# EAGLE design tetris (EAGLE 8.2.2)
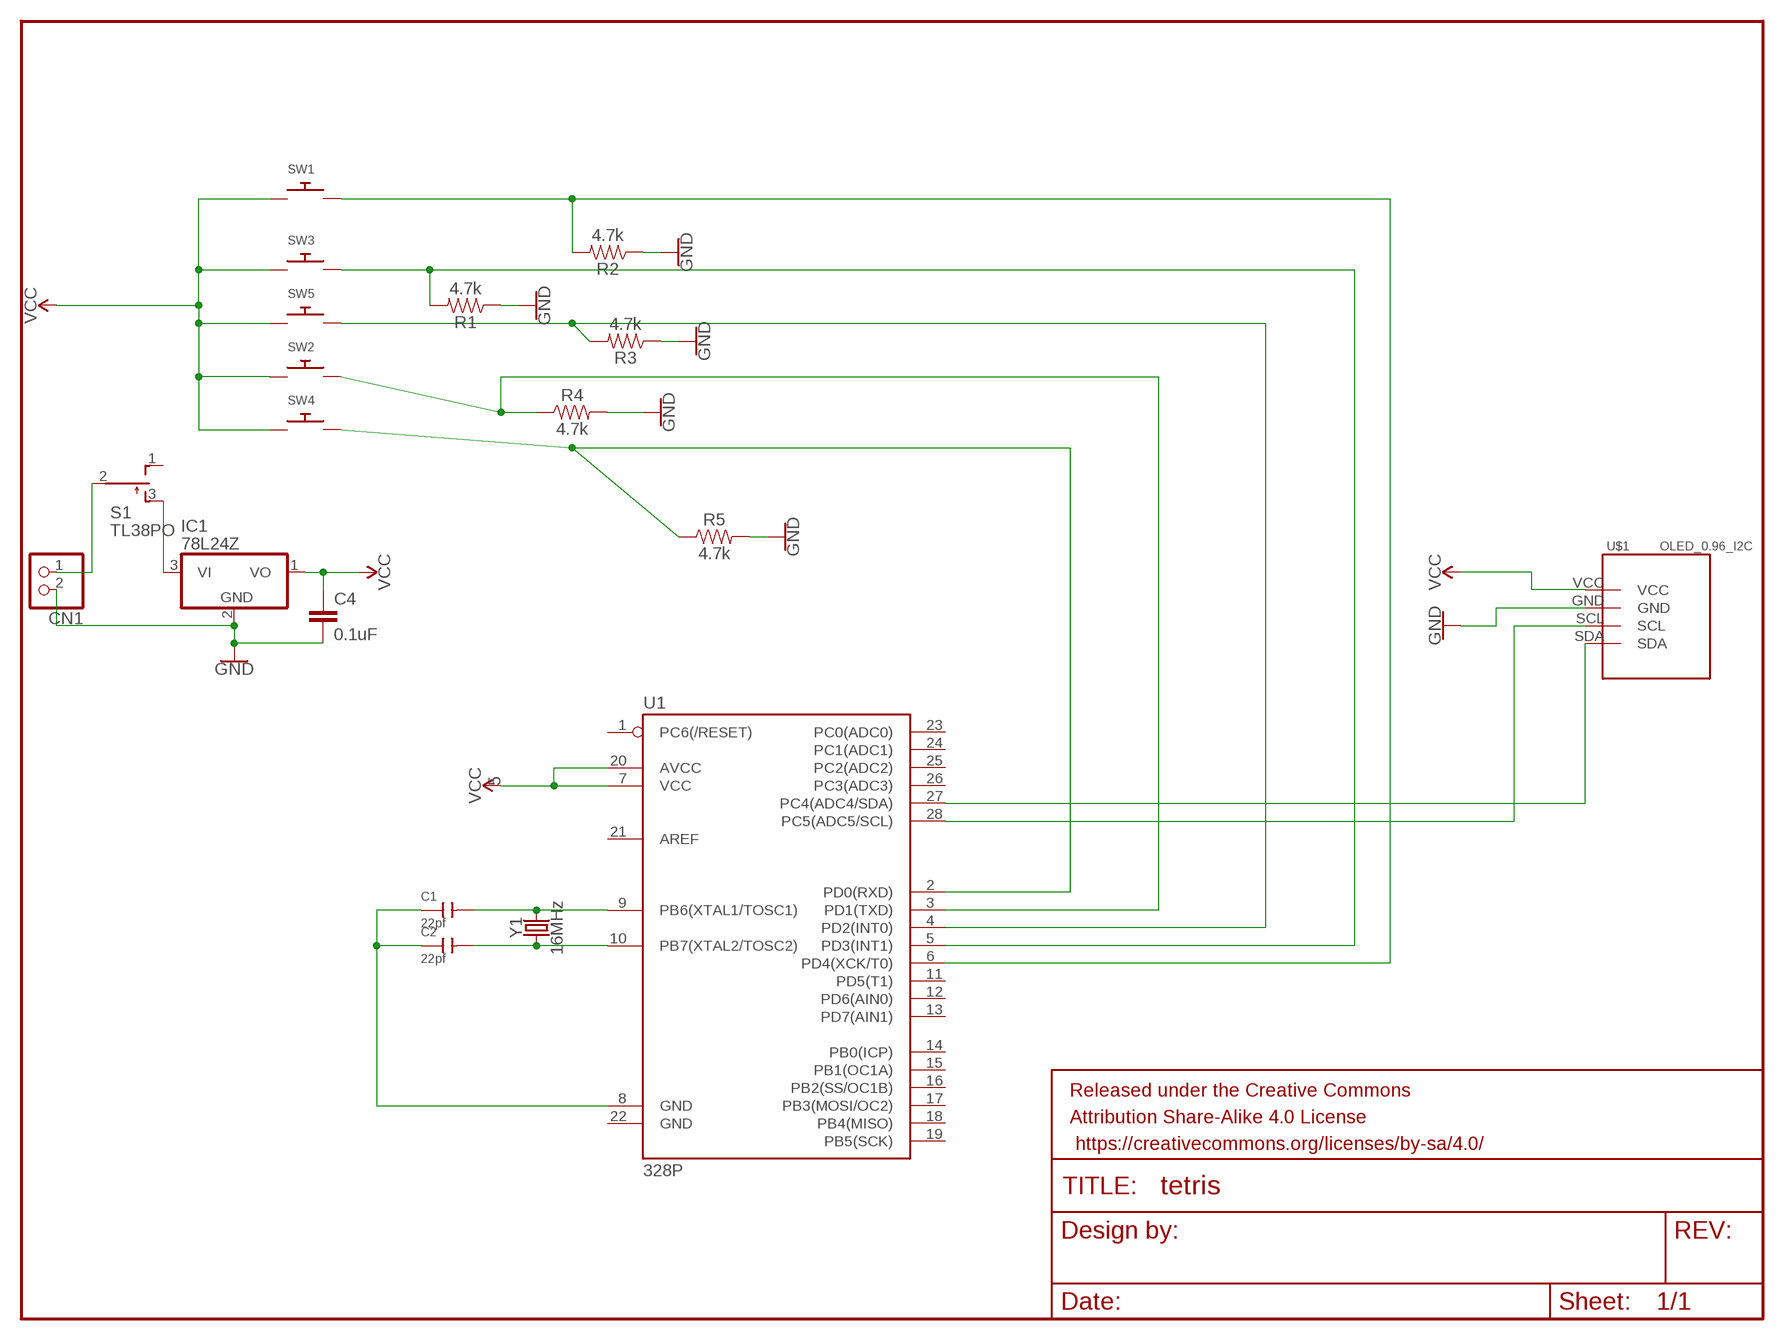
[diagram p0: schematic, sheet 1]

## Parts
C1  22pf  CERAMIC-22PF-50V-5%-NPO(0402)  [C0402]
C2  22pf  CERAMIC-22PF-50V-5%-NPO(0402)  [C0402]
C4  0.1uF  0.1UF-0402-16V-10%  [0402]
CN1  JST_2PIN-SMT-RA  [JST-PH-2-SMT-RA]
FRAME1  FRAME-LETTERNO_PACKAGE  [DUMMY]
IC1  78L24Z  [TO92]
R1  4.7k  4.7KOHM-0603-1/10W-1%  [0603]
R2  4.7k  4.7KOHM-0603-1/10W-1%  [0603]
R3  4.7k  4.7KOHM-0603-1/10W-1%  [0603]
R4  4.7k  4.7KOHM-0603-1/10W-1%  [0603]
R5  4.7k  4.7KOHM-0603-1/10W-1%  [0603]
S1  TL38PO  [TL3XPO]
SW1  SWITCH_PUSHBUTTONC&K_KSS  [BTN_CK_KSS]
SW2  SWITCH_PUSHBUTTONC&K_KSS  [BTN_CK_KSS]
SW3  SWITCH_PUSHBUTTONC&K_KSS  [BTN_CK_KSS]
SW4  SWITCH_PUSHBUTTONC&K_KSS  [BTN_CK_KSS]
SW5  SWITCH_PUSHBUTTONC&K_KSS  [BTN_CK_KSS]
U1  328P  ATMEGA328P_PDIP  [DIP28]
U$1  OLED_0.96_I2C  [OLED_0.96_I2C]
Y1  16MHz  CRYSTAL-16MHZPTH-HC49US  [HC49US]

## Nets
GND: C4.2 CN1.2 IC1.2(GND) R1.1 R2.1 R3.1 R4.2 R5.2 U$1.GND
N$1: R2.2 SW1.P$2 U1.6(PD4(XCK/T0))
N$2: R1.2 SW3.P$2 U1.5(PD3(INT1))
N$3: R3.2 SW5.P$2 U1.4(PD2(INT0))
N$4: R4.1 SW2.P$2 U1.3(PD1(TXD))
N$5: R5.1 SW4.P$2 U1.2(PD0(RXD))
N$6: C1.2 U1.9(PB6(XTAL1/TOSC1)) Y1.2
N$7: C2.2 U1.10(PB7(XTAL2/TOSC2)) Y1.1
N$8: C1.1 C2.1 U1.8(GND)
N$9: CN1.1 S1.2(P)
N$10: U1.27(PC4(ADC4/SDA)) U$1.SDA
N$11: U1.28(PC5(ADC5/SCL)) U$1.SCL
N$12: IC1.3(VI) S1.3(S)
VCC: C4.1 IC1.1(VO) SW1.P$1 SW2.P$1 SW3.P$1 SW4.P$1 SW5.P$1 U1.7(VCC) U1.20(AVCC) U$1.VCC
Unconnected: S1.1(O) U1.1(PC6(/RESET)) U1.11(PD5(T1)) U1.12(PD6(AIN0)) U1.13(PD7(AIN1)) U1.14(PB0(ICP)) U1.15(PB1(OC1A)) U1.16(PB2(SS/OC1B)) U1.17(PB3(MOSI/OC2)) U1.18(PB4(MISO)) U1.19(PB5(SCK)) U1.21(AREF) U1.22(GND) U1.23(PC0(ADC0)) U1.24(PC1(ADC1)) U1.25(PC2(ADC2)) U1.26(PC3(ADC3))

## Library data of the parts
C1 C2 = Seeed-Capacitor:CERAMIC-22PF-50V-5%-NPO(0402): 302010018; MPN: CC0402JRNPO9BN220
C4 = SparkFun-Capacitors:0.1UF: 0.1µF ceramic capacitors A capacitor is a passive two-terminal electrical component used to store electrical energy temporarily in an electric field.; PROD_ID: CAP-12416
CN1 = adafruit:JST_2PIN: JST 2-Pin Connectors of various flavors SMT-RA (S2B-PH-SM4) 4UConnector #17311 SMT (B2B-PH-SM4) THM-RA (S2B-PH) THM (B2B-PH); VOLTS: 5
FRAME1 = SparkFun-Aesthetics:FRAME-LETTER: Schematic Frame - Letter Standard 8.5x11 US Letter frame; DESIGNER: Nobody; VERSION: v01
IC1 = adafruit:78*: Positive VOLTAGE REGULATOR Added bigger pads to the TO-92 package
R1-R5 = SparkFun-Resistors:4.7KOHM: 4.7kΩ resistor A resistor is a passive two-terminal electrical component that implements electrical resistance as a circuit element. Resistors act to reduce current flow, and, at the same time, act to lower voltage levels within circuits. - Wikipedia; PROD_ID: RES-07857
S1 = switch:TL38PO: TINY SWITCH ON OFF MOM Source: http://www2.produktinfo.conrad.com/datenblaetter/700000-724999/705152-da-01-de-Subminiaturschalter_TL_36YO.pdf
SW1 = adafruit:SWITCH_PUSHBUTTON: Buttons SOFTTOUCHSMD_SJ - Soft touch temporary push button (Super Junk Akihabara) Compatible with SKPMANE010 [Mouser: 688-SKPMAN] C&K_KSS = Digikey: KSS221GLFS; PIN: D4
SW2 = adafruit:SWITCH_PUSHBUTTON: Buttons SOFTTOUCHSMD_SJ - Soft touch temporary push button (Super Junk Akihabara) Compatible with SKPMANE010 [Mouser: 688-SKPMAN] C&K_KSS = Digikey: KSS221GLFS; PIN: D1
SW3 = adafruit:SWITCH_PUSHBUTTON: Buttons SOFTTOUCHSMD_SJ - Soft touch temporary push button (Super Junk Akihabara) Compatible with SKPMANE010 [Mouser: 688-SKPMAN] C&K_KSS = Digikey: KSS221GLFS; PIN: D3
SW4 = adafruit:SWITCH_PUSHBUTTON: Buttons SOFTTOUCHSMD_SJ - Soft touch temporary push button (Super Junk Akihabara) Compatible with SKPMANE010 [Mouser: 688-SKPMAN] C&K_KSS = Digikey: KSS221GLFS; PIN: D0
SW5 = adafruit:SWITCH_PUSHBUTTON: Buttons SOFTTOUCHSMD_SJ - Soft touch temporary push button (Super Junk Akihabara) Compatible with SKPMANE010 [Mouser: 688-SKPMAN] C&K_KSS = Digikey: KSS221GLFS; PIN: D2
U1 = SparkFun-IC-Microcontroller:ATMEGA328P_PDIP: Atmel 328P Through hole ATMEGA328P uC used in the Arduino 32kb flash, 1k EEPROM, 2k SRAM Datasheet <http://www.sparkfun.com/datasheets/Components/SMD/ATMega328.pdf> SparkFun Products Storefront component: AVR 28 Pin 20MHz 32K 6A/D - ATMega328P <https://www.sparkfun.com/products/9061> (COM-09061) SparkFun Simon Says - Through-Hole Soldering Kit <https://www.sparkfun.com/products/10547> (KIT-10547) SparkFun Learn to Solder - Simon Says <https://www.sparkfun.com/products/13708> (KIT-13708) SparkFun BigTime Watch Kit <https://www.sparkfun.com/products/11734> (KIT-11734) SparkFun ClockIt <https://www.sparkfun.com/products/10930> (KIT-10930) SparkFun Serial Enabled LCD Kit <https://www.sparkfun.com/products/10097> (LCD-10097) SparkFun Simon Tilts - Through Hole Soldering Kit <https://www.sparkfun.com/products/12634> (KIT-12634) SparkFun Frequency Counter Kit <https://www.sparkfun.com/products/10140> (KIT-10140) FabFM Radio Kit <https://www.sparkfun.com/products/11043> (KIT-11043) SparkFun Binary Blaster Kit <https://www.sparkfun.com/products/12037> (KIT-12037) SparkFun Metro-Gnome <https://www.sparkfun.com/products/9236> (KIT-09236) ATmega328 with Arduino Optiboot (Uno) <https://www.sparkfun.com/products/10524> (DEV-10524); PROD_ID: IC-09136
U$1 = tft_1.8_1.44_oled_0.96:OLED_0.96_I2C
Y1 = SparkFun-Clocks:CRYSTAL-16MHZ: 16MHz Crystal Digikey Example <http://www.digikey.com/product-search/en?keywords=535-9122-1-ND> Frequency: 16MHz Frequency Stability: ±50ppm Frequency Tolerance: ±20ppm Load Capacitance: 18pF SparkFun Products: Pro Micro -5V/16MHz <https://www.sparkfun.com/products/12640> SparkFun Serial Enabled LCD Kit <https://www.sparkfun.com/products/10097>; PROD_ID: XTAL-08181; SF_ID: COM-00536

## Board
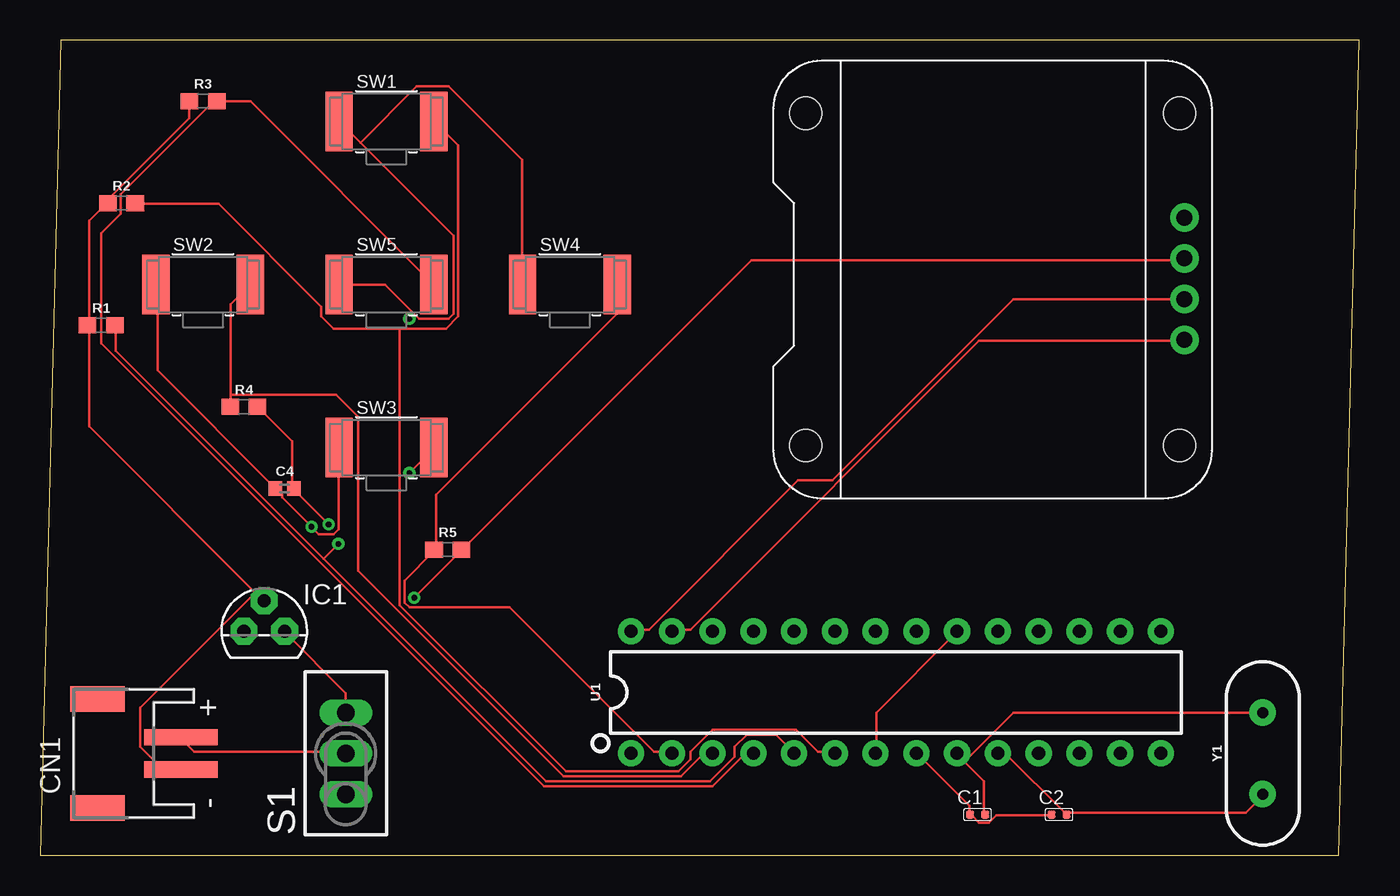
[diagram p1: board, top side]
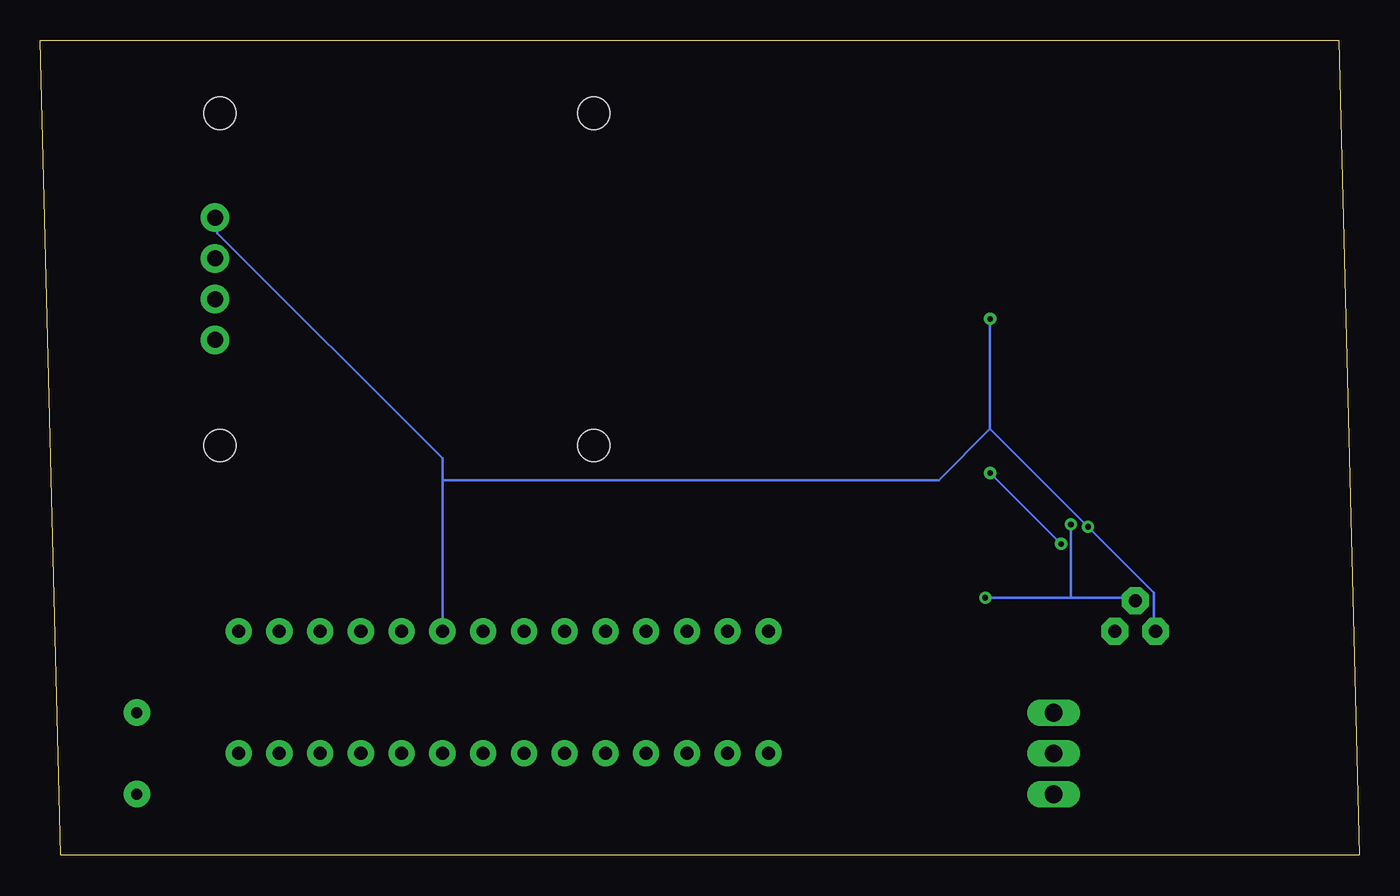
[diagram p2: board, bottom side, seen from below]

Size 82.22 x 50.79 mm. Coordinates in mm from the lower left corner, seen from the top.
Outline: 0,0 80.95,0 82.22,50.79 1.27,50.79 0,0
Copper layers (1*16): Top 0.035mm / dielectric 1.5mm / Bottom 0.035mm
Design rules "default": minimum track width 6mil, minimum drill 0.35mm, track to track 6mil, track to pad 6mil, pad to pad 6mil, via to via 6mil, smd to smd 6mil, copper to edge 40mil, drill to drill 6mil, minimum pad ring 10mil, minimum via ring 8mil, stop-mask expansion 4mil, vias tented up to drill 0mil, thermal gap 10mil

### Footprints (pad centres in the part's own frame; a part is rotated, then mirrored left to right if it is on the bottom)
C0402 = smd 0.5 x 0.5: 1 0,0.463; 2 0,-0.463
0402 = smd 0.85 x 0.9: 1 -0.58,0; 2 0.58,0
JST-PH-2-SMT-RA = smd 1 x 4.6: 1 1,-3.7; 2 -1,-3.7 | smd 1.6 x 3.4: NC1 -3.4,1.5; NC2 3.4,1.5
TO92 = drill 0.813 pad 1.676 octagon: 1 -1.27,0; 2 0,1.905; 3 1.27,0
0603 = smd 1.1 x 1: 1 -0.85,0; 2 0.85,0
TL3XPO = drill 1.1 pad 1.422 long: 1 -2.54,0; 2 0,0; 3 2.54,0
BTN_CK_KSS = smd 1.7 x 3.7: P$1 -2.95,0; P$2 2.95,0
DIP28 = drill 0.813 pad 1.626: 1 -16.51,-3.81; 2 -13.97,-3.81; 3 -11.43,-3.81; 4 -8.89,-3.81; 5 -6.35,-3.81; 6 -3.81,-3.81; 7 -1.27,-3.81; 8 1.27,-3.81; 9 3.81,-3.81; 10 6.35,-3.81; 11 8.89,-3.81; 12 11.43,-3.81; 13 13.97,-3.81; 14 16.51,-3.81; 15 16.51,3.81; 16 13.97,3.81; 17 11.43,3.81; 18 8.89,3.81; 19 6.35,3.81; 20 3.81,3.81; 21 1.27,3.81; 22 -1.27,3.81; 23 -3.81,3.81; 24 -6.35,3.81; 25 -8.89,3.81; 26 -11.43,3.81; 27 -13.97,3.81; 28 -16.51,3.81
OLED_0.96_I2C = drill 1 pad 1.778: GND -1.63,11.63; SCL 0.91,11.63; SDA 3.45,11.63; VCC -4.17,11.63 | hole 2: -10.67,-11.97; 10.03,-11.97; 10.03,11.33; -10.67,11.33
HC49US = drill 0.7 pad 1.651: 1 -2.54,0; 2 2.54,0

### Placement (x,y rotation side)
C1  58.42,2.54 90 top
C2  63.5,2.54 90 top
C4  15.24,22.86 0 top
CN1  5.08,6.35 90 top
FRAME1  -43.18,55.88 0 top  (outside the outline)
IC1  13.97,13.97 0 top
R1  3.81,33.02 0 top
R2  5.08,40.64 0 top
R3  10.16,46.99 0 top
R4  12.7,27.94 0 top
R5  25.4,19.05 0 top
S1  19.05,6.35 90 top
SW1  21.59,45.72 0 top
SW2  10.16,35.56 0 top
SW3  21.59,25.4 0 top
SW4  33.02,35.56 0 top
SW5  21.59,35.56 0 top
U1  53.34,10.16 0 top
U$1  59.69,35.56 270 top
Y1  76.2,6.35 90 top

### Tracks (layer width: path | path; a pad name or v marks a point on that pad's centre or on a via)
GND  (via drill 0.35)
  Top 0.152: R3.1 9.3,46.99 9.3,45.92 4.11,40.74 R2.1 4.11,40.59 3.05,39.52 3.05,33.12 R1.1 3.05,32.97 3.05,26.72 13.41,16.36 | R4.2 13.56,27.94 15.7,25.81 15.7,22.91 C4.2 15.85,22.76 v17.98,20.62 | v23.32,16.05 26.21,18.95 R5.2 26.36,19.1 44.35,37.08 71.17,37.08 U$1.GND | 13.41,16.36 13.87,15.9 IC1.2 13.41,16.36 | 13.41,16.36 6.25,9.2 6.25,6.76 7.62,5.38 8.69,5.38 CN1.2
  Bottom 0.152: 17.98,16.05 14.17,16.05 14.02,15.9 IC1.2 | 17.98,16.05 v23.32,16.05 | 17.98,16.05 v17.98,20.62
N$1
  Top 0.152: 22.4,32.82 25.3,32.82 26.06,33.58 26.06,44.25 24.69,45.62 SW1.P$2 | 22.4,32.82 18.29,32.82 17.53,33.58 17.53,34.19 11.12,40.59 5.94,40.59 R2.2 | 22.4,32.82 22.4,15.6 32.77,5.23 39.78,5.23 40.54,5.99 40.54,6.45 41.91,7.82 47.09,7.82 48.46,6.45 49.53,6.45 U1.6
N$2  (via drill 0.35)
  Top 0.152: 17.68,18.49 31.55,4.62 41.76,4.62 43.28,6.15 43.28,6.76 44.04,7.52 45.87,7.52 46.94,6.45 U1.5 | 17.68,18.49 4.72,31.45 4.72,32.97 R1.2 | v23.01,23.82 24.54,25.35 SW3.P$2 | 17.68,18.49 v18.59,19.41
  Bottom 0.152: v18.59,19.41 v23.01,23.82
N$3
  Top 0.152: SW5.P$2 13.11,46.99 R3.2 10.82,46.99 5.03,41.2 5.03,39.98 3.81,38.76 3.81,31.9 31.39,4.32 41.91,4.32 43.89,6.3 44.35,6.3 U1.4
N$4
  Top 0.152: 11.89,28.7 11.89,34.34 SW2.P$2 | 11.89,28.7 11.89,27.94 R4.1 | 11.89,28.7 18.44,28.7 19.81,27.33 19.81,17.73 32.61,4.93 39.93,4.93 41.3,6.3 41.91,6.3 U1.3
N$5
  Top 0.152: SW4.P$2 35.97,33.73 24.69,22.45 24.69,19.1 R5.1 24.54,18.95 22.71,17.12 22.71,15.75 23.01,15.44 29.26,15.44 38.25,6.45 39.32,6.45 U1.2
N$6
  Top 0.152: 57.61,5.84 57.15,6.3 U1.9 57.61,5.84 | 57.61,5.84 58.83,4.62 58.83,2.64 C1.2 | Y1.2 60.66,8.89 57.61,5.84
N$7
  Top 0.152: U1.10 59.74,6.3 60.2,6.3 63.86,2.64 C2.2 64.01,2.64 75.13,2.64 76.2,3.71 Y1.1
N$8
  Top 0.152: U1.8 54.71,6.3 57.91,3.1 57.91,2.64 C1.1 58.06,2.49 58.52,2.03 59.13,2.03 59.59,2.49 62.94,2.49 C2.1
N$9
  Top 0.152: S1.2 19.05,6.45 9.6,6.45 8.84,7.21 CN1.1
N$10
  Top 0.152: U1.27 39.47,14.07 40.54,14.07 58.52,32.05 71.17,32.05 U$1.SDA
N$11
  Top 0.152: U1.28 36.88,14.07 37.95,14.07 47.24,23.37 49.38,23.37 60.66,34.65 71.17,34.65 U$1.SCL
N$12
  Top 0.152: S1.3 19.05,10.11 15.24,13.92 IC1.3
VCC  (via drill 0.35)
  Top 0.152: U1.7 52.12,6.45 52.12,8.89 57.15,13.92 U1.20 | SW5.P$1 21.49,35.56 23.32,33.73 | 23.32,33.73 23.62,33.43 25.45,33.43 25.76,33.73 25.76,38.61 19.96,44.4 | 19.96,44.4 18.74,45.62 SW1.P$1 | 19.96,44.4 23.47,47.9 25.45,47.9 30.02,43.33 30.02,35.56 SW4.P$1 | SW3.P$1 18.59,25.35 18.59,20.32 18.29,20.02 17.37,20.02 v16.92,20.47 15.09,22.3 15.09,22.45 14.78,22.76 C4.1 14.63,22.91 7.32,30.23 7.32,35.56 SW2.P$1 | v23.01,33.43 23.32,33.73
  Bottom 0.152: U1.20 57.15,23.37 | 57.15,23.37 57.15,24.74 71.17,38.76 71.17,39.68 U$1.VCC | IC1.1 12.8,14.07 12.8,16.36 v16.92,20.47 23.01,26.57 | 23.01,26.57 v23.01,33.43 | 57.15,23.37 26.21,23.37 23.01,26.57